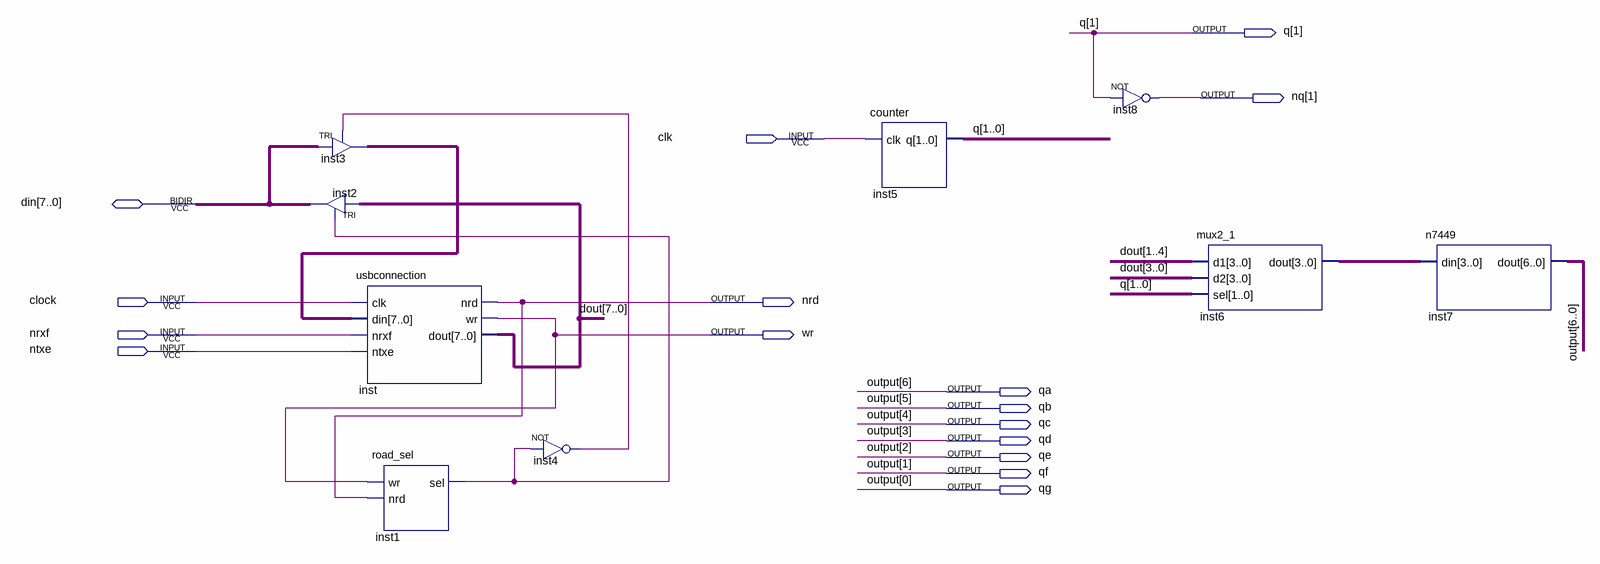
[diagram p0: schematic sheet]
// Quartus schematic crc.bdf as structural Verilog: 9 symbols, 16 pins
module crc (
  input  clk,
  input  clock,
  input  nrxf,
  input  ntxe,
  inout  [7:0] din,
  output [1:0] q,
  output [1:1] nq,
  output nrd,
  output wr,
  output qa,
  output qb,
  output qc,
  output qd,
  output qe,
  output qf,
  output qg
);

  wire inst1_sel, inst4_out;
  wire [3:0] inst6_dout;
  wire [7:0] dout, inst3_out;

  TRI inst3[7:0] (.IN(din), .OE(inst4_out), .OUT(inst3_out));
  TRI inst2[7:0] (.IN(dout), .OE(inst1_sel), .OUT(din));
  usbconnection inst (.clk(clock), .din(inst3_out), .nrxf(nrxf), .ntxe(ntxe), .nrd(nrd), .wr(wr), .dout(dout));
  road_sel inst1 (.wr(wr), .nrd(nrd), .sel(inst1_sel));
  not inst4 (inst4_out, inst1_sel);
  counter inst5 (.clk(clk), .q(q));
  not inst8 (nq[1], q[1]);
  mux2_1 inst6 (.d1({dout[1], dout[2], dout[3], dout[4]}), .d2(dout[3:0]), .sel(q), .dout(inst6_dout));
  n7449 inst7 (.din(inst6_dout), .dout({qa, qb, qc, qd, qe, qf, qg}));

  // Other names for the same wires on the sheet: output[6:0] = {qa, qb, qc, qd, qe, qf, qg}
endmodule
